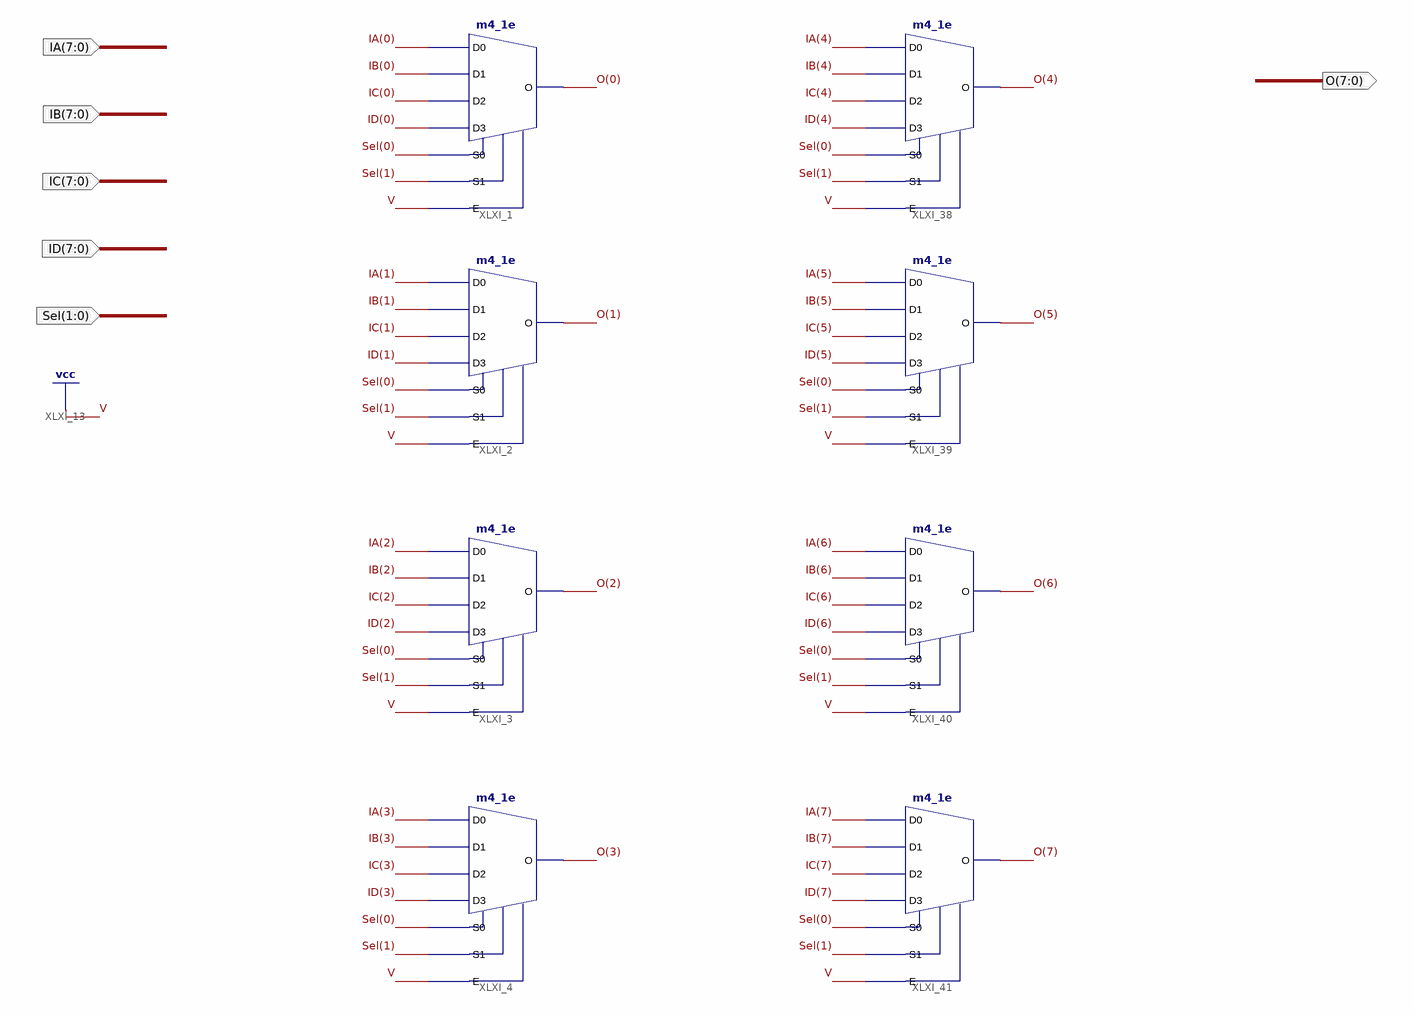
[diagram p0: schematic sheet 1]
// Xilinx ISE schematic mux8b4.sch (spartan3e) as structural Verilog: 8 symbols, 6 ports
module mux8b4 (
  input  [7:0] IA,
  input  [7:0] IB,
  input  [7:0] IC,
  input  [7:0] ID,
  input  [1:0] Sel,
  output [7:0] O
);

  m4_1e XLXI_1 (.D0(IA[0]), .D1(IB[0]), .D2(IC[0]), .D3(ID[0]), .E(1'b1), .S0(Sel[0]), .S1(Sel[1]), .O(O[0]));
  m4_1e XLXI_2 (.D0(IA[1]), .D1(IB[1]), .D2(IC[1]), .D3(ID[1]), .E(1'b1), .S0(Sel[0]), .S1(Sel[1]), .O(O[1]));
  m4_1e XLXI_3 (.D0(IA[2]), .D1(IB[2]), .D2(IC[2]), .D3(ID[2]), .E(1'b1), .S0(Sel[0]), .S1(Sel[1]), .O(O[2]));
  m4_1e XLXI_4 (.D0(IA[3]), .D1(IB[3]), .D2(IC[3]), .D3(ID[3]), .E(1'b1), .S0(Sel[0]), .S1(Sel[1]), .O(O[3]));
  m4_1e XLXI_38 (.D0(IA[4]), .D1(IB[4]), .D2(IC[4]), .D3(ID[4]), .E(1'b1), .S0(Sel[0]), .S1(Sel[1]), .O(O[4]));
  m4_1e XLXI_39 (.D0(IA[5]), .D1(IB[5]), .D2(IC[5]), .D3(ID[5]), .E(1'b1), .S0(Sel[0]), .S1(Sel[1]), .O(O[5]));
  m4_1e XLXI_40 (.D0(IA[6]), .D1(IB[6]), .D2(IC[6]), .D3(ID[6]), .E(1'b1), .S0(Sel[0]), .S1(Sel[1]), .O(O[6]));
  m4_1e XLXI_41 (.D0(IA[7]), .D1(IB[7]), .D2(IC[7]), .D3(ID[7]), .E(1'b1), .S0(Sel[0]), .S1(Sel[1]), .O(O[7]));
endmodule
